# Altium project Electrodos.PrjPcb
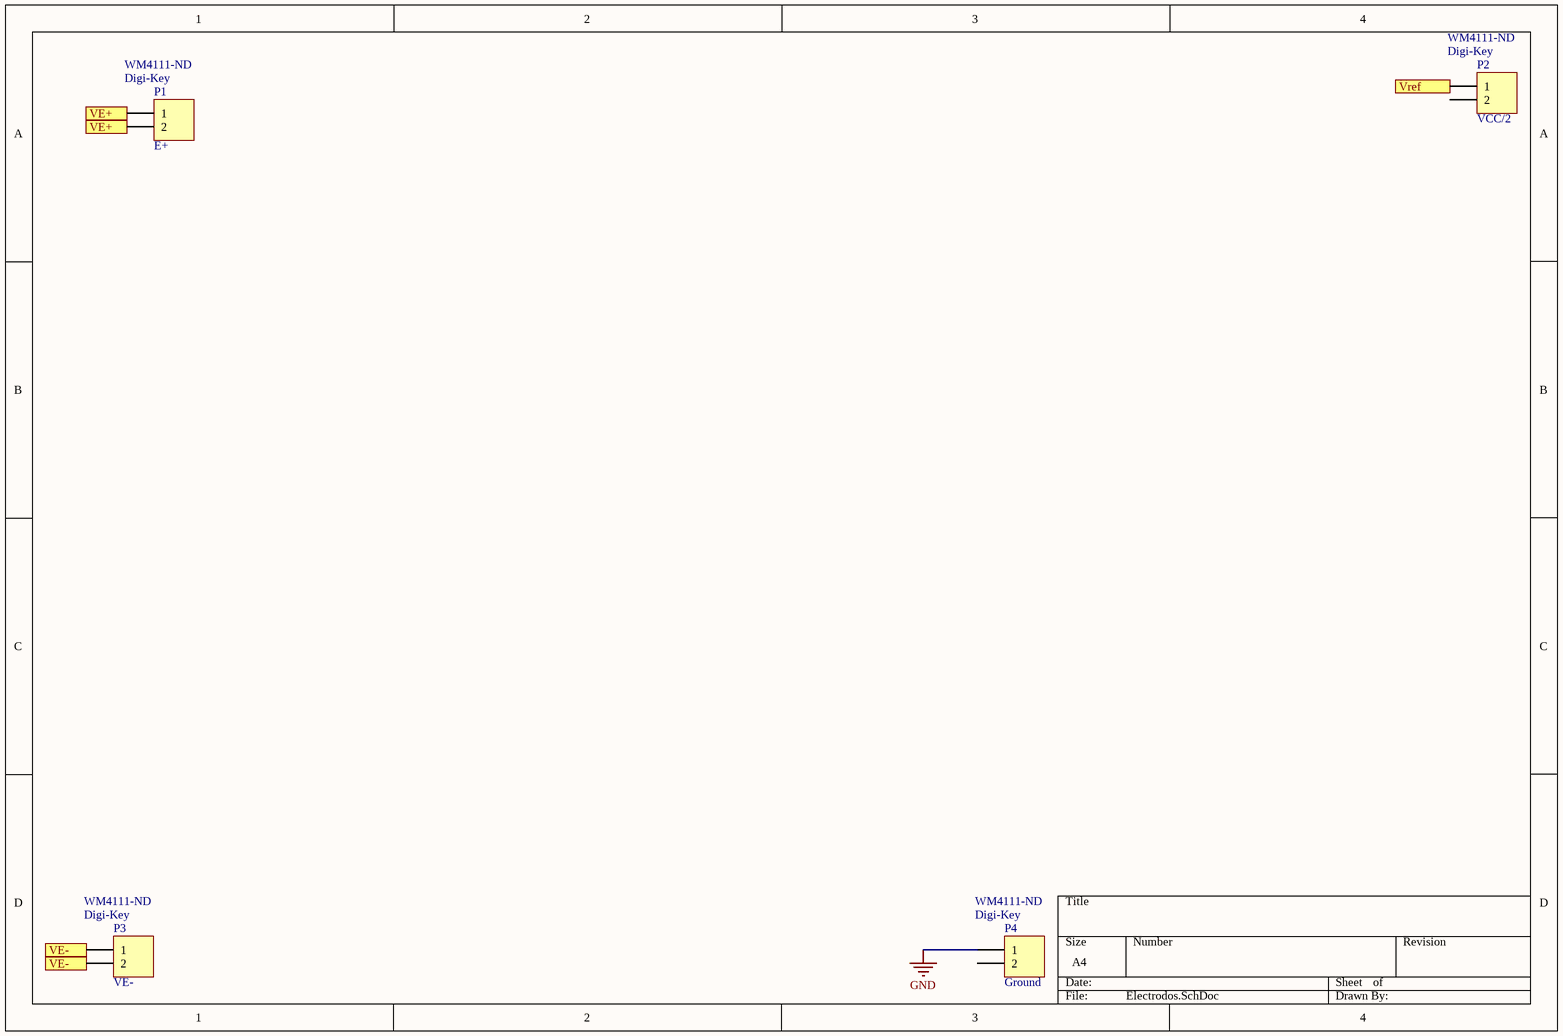
[diagram p0: Electrodos.SchDoc]
1 sheet, 4 parts. Net scope: flat (ports and power ports of the same name join across sheets).
Board file: Electrodos.PcbDoc

## Sheet Electrodos.SchDoc
size A4; SheetNumber: 1; SheetTotal: 1

### Parts
P1  E+  Supplier 1: Digi-Key  Supplier Part Number 1: WM4111-ND  [HDR1X2]
P2  VCC/2  Supplier 1: Digi-Key  Supplier Part Number 1: WM4111-ND  [HDR1X2]
P3  VE-  Supplier 1: Digi-Key  Supplier Part Number 1: WM4111-ND  [HDR1X2]
P4  Ground  Supplier 1: Digi-Key  Supplier Part Number 1: WM4111-ND  [HDR1X2]

### Ports
VE+ (see Electrodos[1A]), VE- (see Electrodos[1D]), Vref

### Nets
GND: P4.1
NetP1_1: P1.1 P1.2 ; port VE+
NetP2_1: P2.1 ; port Vref
NetP3_1: P3.1 P3.2 ; port VE-

Not connected (* = marked no-connect by the designer): P2 2; P4 2

### Library data of the parts
P1-P4 = Header 2: Header, 2-Pin; LatestRevisionDate: 17-Jul-2002; LatestRevisionNote: Re-released for DXP Platform.; Publisher: Altium Limited